# EAGLE design 9DOF-Razor-v14 (EAGLE 5.04)

## Sheet 1 of 2
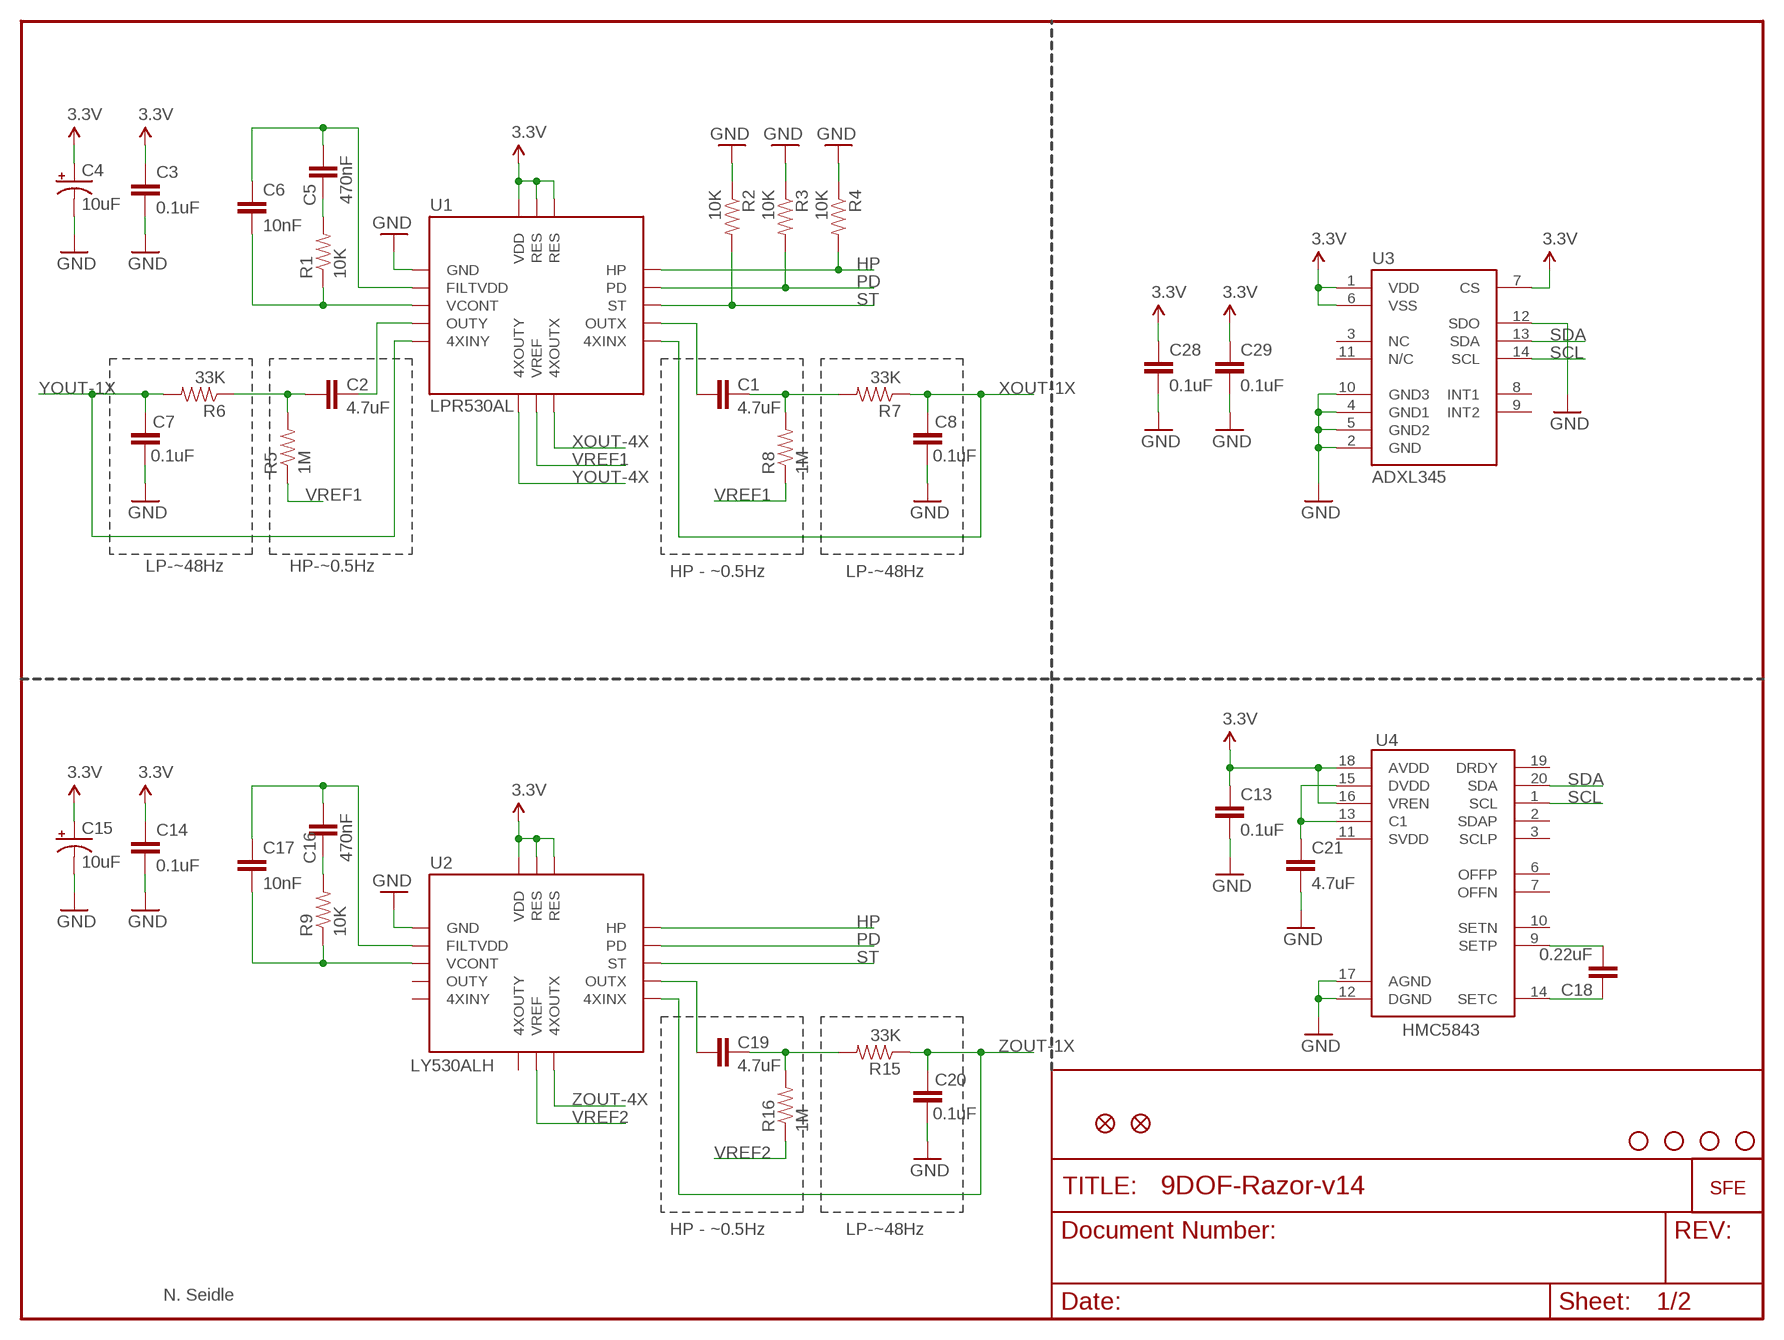
[diagram p0: schematic, sheet 1]

### Parts
C1  4.7uF  CAP0402-CAP  [0402-CAP]
C2  4.7uF  CAP0402-CAP  [0402-CAP]
C3  0.1uF  CAP0402-CAP  [0402-CAP]
C4  10uF  CAP_POL1206  [EIA3216]
C5  470nF  CAP0402-CAP  [0402-CAP]
C6  10nF  CAP0402-CAP  [0402-CAP]
C7  0.1uF  CAP0402-CAP  [0402-CAP]
C8  0.1uF  CAP0402-CAP  [0402-CAP]
C13  0.1uF  CAP0402-CAP  [0402-CAP]
C14  0.1uF  CAP0402-CAP  [0402-CAP]
C15  10uF  CAP_POL1206  [EIA3216]
C16  470nF  CAP0402-CAP  [0402-CAP]
C17  10nF  CAP0402-CAP  [0402-CAP]
C18  0.22uF  CAP0402-CAP  [0402-CAP]
C19  4.7uF  CAP0402-CAP  [0402-CAP]
C20  0.1uF  CAP0402-CAP  [0402-CAP]
C21  4.7uF  CAP0402-CAP  [0402-CAP]
C28  0.1uF  CAP0402-CAP  [0402-CAP]
C29  0.1uF  CAP0402-CAP  [0402-CAP]
JP2  STAND-OFF  [STAND-OFF]
JP3  LOGO-SFENEW  [SFE-NEW-WEBLOGO]
JP4  STAND-OFF  [STAND-OFF]
JP5  STAND-OFF  [STAND-OFF]
JP6  STAND-OFF  [STAND-OFF]
JP8  FIDUCIAL1X2  [FIDUCIAL-1X2]
JP9  FIDUCIAL1X2  [FIDUCIAL-1X2]
R1  10K  RESISTOR0402-RES  [0402-RES]
R2  10K  RESISTOR0402-RES  [0402-RES]
R3  10K  RESISTOR0402-RES  [0402-RES]
R4  10K  RESISTOR0402-RES  [0402-RES]
R5  1M  RESISTOR0402-RES  [0402-RES]
R6  33K  RESISTOR0402-RES  [0402-RES]
R7  33K  RESISTOR0402-RES  [0402-RES]
R8  1M  RESISTOR0402-RES  [0402-RES]
R9  10K  RESISTOR0402-RES  [0402-RES]
R15  33K  RESISTOR0402-RES  [0402-RES]
R16  1M  RESISTOR0402-RES  [0402-RES]
U1  LPR530AL  ST-GYROLGA  [ST-GYRO]
U2  LY530ALH  ST-GYROLGA  [ST-GYRO]
U3  ADXL345  [LGA14]
U4  HMC5843  HMC5843SMD  [LPCC20]

### Nets
3.3V: C3.1 C4.A(+) C13.1 C14.1 C15.A(+) C28.1 C29.1 U1.14(RES) U1.15(RES) U1.16(VDD) U2.14(RES) U2.15(RES) U2.16(VDD) U3.1(VDD) U3.6(VSS) U3.7(CS) U4.16(VREN) U4.18(AVDD) ; also sheet 2
F1: C5.1 C6.1 U1.2(FILTVDD)
F2: C6.2 R1.1 U1.3(VCONT)
F3: C16.1 C17.1 U2.2(FILTVDD)
F4: C17.2 R9.1 U2.3(VCONT)
GND: C3.2 C4.C(-) C7.1 C8.1 C13.2 C14.2 C15.C(-) C20.1 C21.2 C28.2 C29.2 R2.1 R3.1 R4.1 U1.1(GND) U2.1(GND) U3.2(GND) U3.4(GND1) U3.5(GND2) U3.10(GND3) U3.12(SDO) U4.12(DGND) U4.17(AGND) ; also sheet 2
HP: R4.2 U1.13(HP) U2.13(HP) ; also sheet 2
N$1: C2.2 U1.4(OUTY)
N$2: C5.2 R1.2
N$3: C1.1 U1.10(OUTX)
N$4: C2.1 R5.2 R6.1
N$5: C21.1 U4.13(C1) U4.15(DVDD)
N$6: C1.2 R7.2 R8.2
N$7: C18.1 U4.14(SETC)
N$8: C16.2 R9.2
N$9: C19.1 U2.10(OUTX)
N$10: C19.2 R15.2 R16.2
N$11: C18.2 U4.9(SETP)
PD: R3.2 U1.12(PD) U2.12(PD) ; also sheet 2
SCL: U3.14(SCL) U4.1(SCL) ; also sheet 2
SDA: U3.13(SDA) U4.20(SDA) ; also sheet 2
ST: R2.2 U1.11(ST) U2.11(ST) ; also sheet 2
VREF1: R5.1 R8.1 U1.7(VREF) ; also sheet 2
VREF2: R16.1 U2.7(VREF) ; also sheet 2
XOUT-1X: C8.2 R7.1 U1.9(4XINX)
XOUT-4X: U1.8(4XOUTX) ; also sheet 2
YOUT-1X: C7.2 R6.2 U1.5(4XINY)
YOUT-4X: U1.6(4XOUTY) ; also sheet 2
ZOUT-1X: C20.2 R15.1 U2.9(4XINX)
ZOUT-4X: U2.8(4XOUTX) ; also sheet 2
Unconnected: U2.4(OUTY) U2.5(4XINY) U2.6(4XOUTY) U3.3(NC) U3.8(INT1) U3.9(INT2) U3.11(N/C) U4.2(SDAP) U4.3(SCLP) U4.6(OFFP) U4.7(OFFN) U4.10(SETN) U4.11(SVDD) U4.19(DRDY)

### Notes on the sheet
- LP-~48Hz | HP-~0.5Hz
- HP - ~0.5Hz | LP-~48Hz
- HP - ~0.5Hz | LP-~48Hz
- N. Seidle

## Sheet 2 of 2
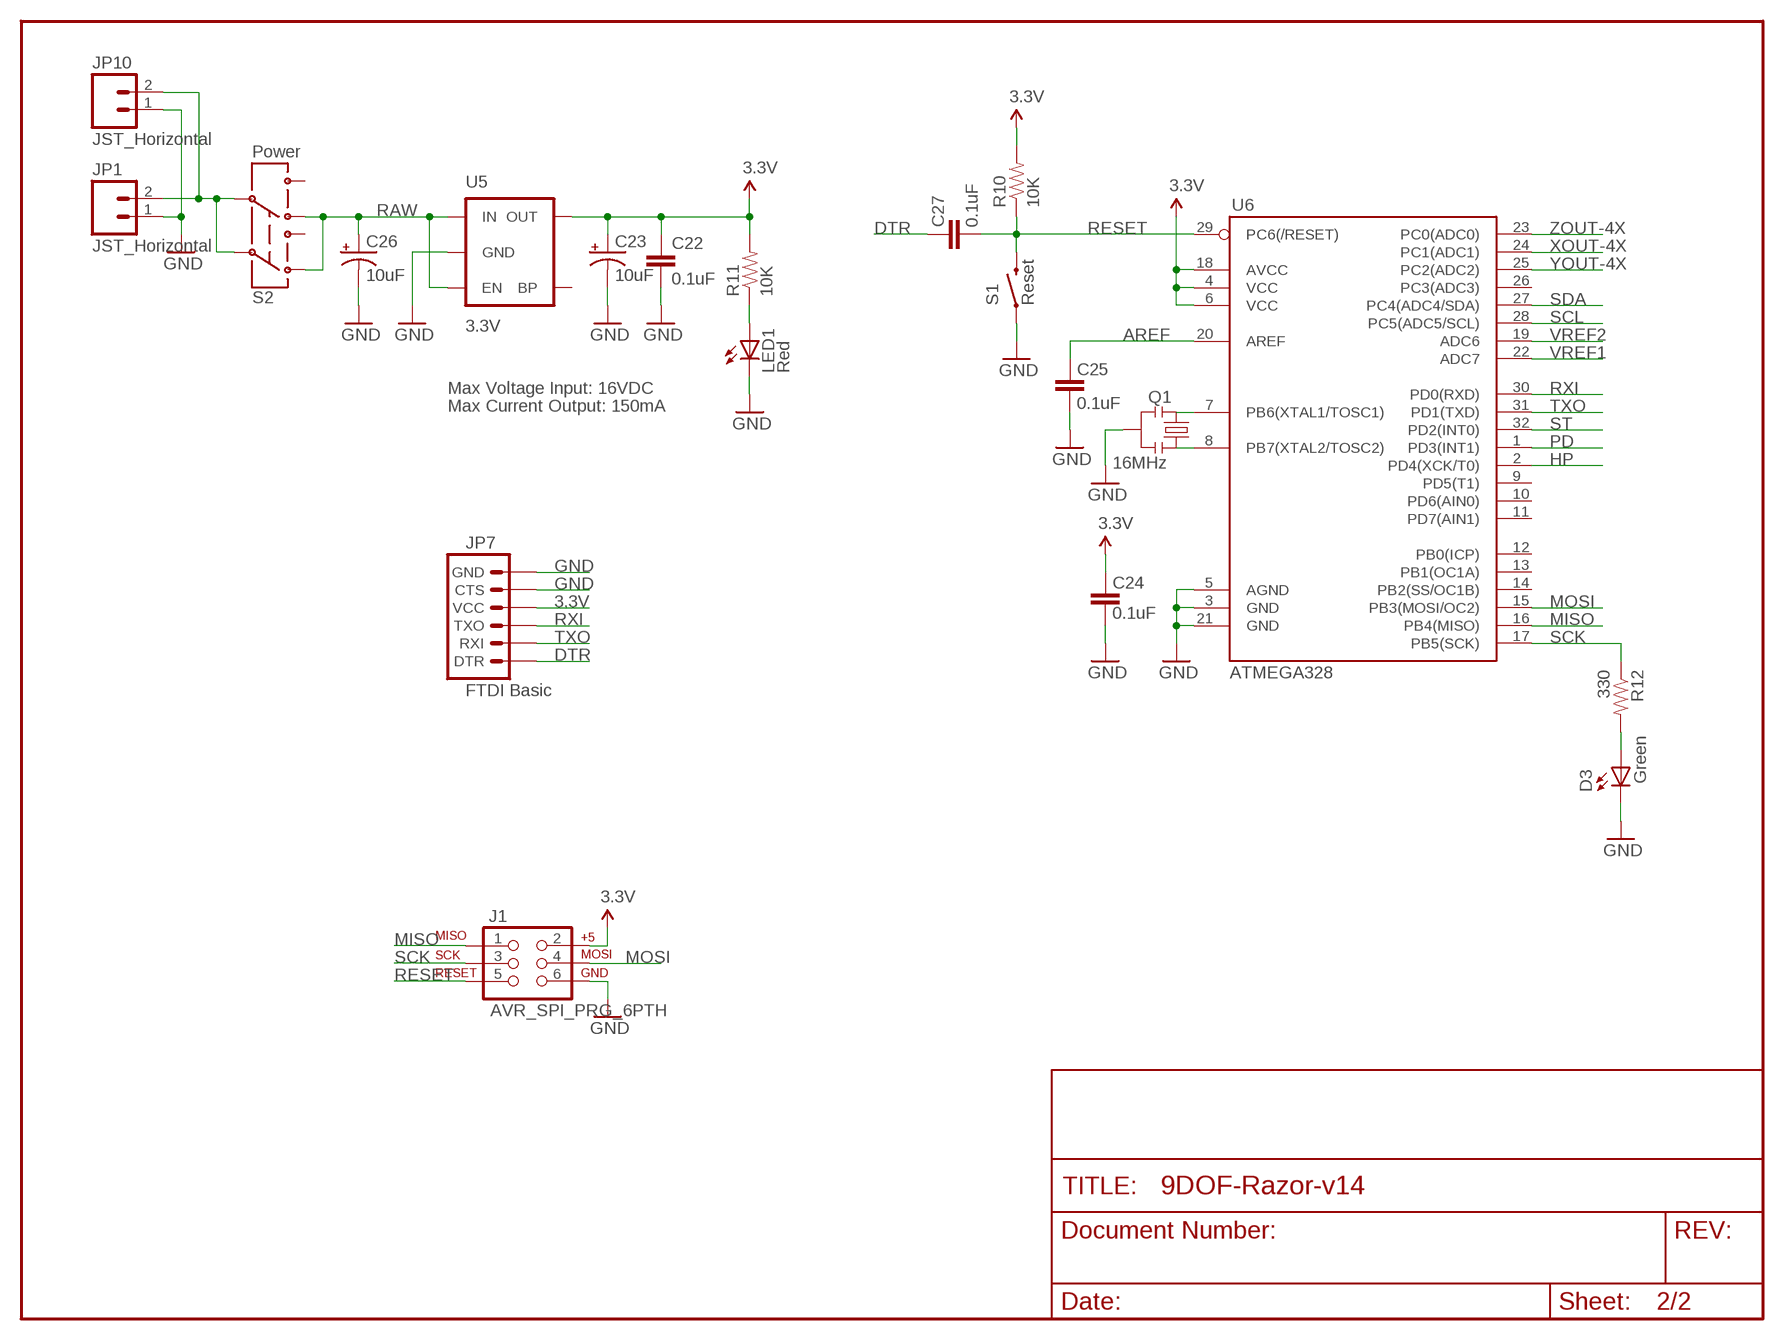
[diagram p1: schematic, sheet 2]

### Parts
C22  0.1uF  CAP0402-CAP  [0402-CAP]
C23  10uF  CAP_POL1206  [EIA3216]
C24  0.1uF  CAP0402-CAP  [0402-CAP]
C25  0.1uF  CAP0402-CAP  [0402-CAP]
C26  10uF  CAP_POL1206  [EIA3216]
C27  0.1uF  CAP0402-CAP  [0402-CAP]
D3  Green  LED0603  [LED-0603]
J1  AVR_SPI_PRG_6PTH  [2X3]
JP1  JST_Horizontal  M02-JST-2MM-SMT  [S2B-PH]
JP7  FTDI Basic  ARDUINO_SERIAL_PROGRAMPTH  [1X06]
JP10  JST_Horizontal  M02PTH  [1X02]
LED1  Red  LED0603  [LED-0603]
Q1  16MHz  RESONATORSMD  [RESONATOR-SMD]
R10  10K  RESISTOR0402-RES  [0402-RES]
R11  10K  RESISTOR0402-RES  [0402-RES]
R12  330  RESISTOR0402-RES  [0402-RES]
S1  Reset  SWITCH-MOMENTARY-2SMD  [TACTILE_SWITCH_SMD]
S2  Power  SWITCH-DPDTSMD  [AYZ0202]
U5  3.3V  V_REG_LDOSMD  [SOT23-5]
U6  ATMEGA328  ATMEGA168  [TQFP32-08]

### Nets
3.3V: C22.1 C23.A(+) C24.2 J1.2 JP7.4(VCC) R10.2 R11.2 U5.5(OUT) U6.4(VCC) U6.6(VCC) U6.18(AVCC) ; also sheet 1
AREF: C25.2 U6.20(AREF)
DTR: C27.2 JP7.1(DTR)
GND: C22.2 C23.C(-) C24.1 C25.1 C26.C(-) D3.C J1.6 JP1.1 JP7.5(CTS) JP7.6(GND) JP10.1 LED1.C Q1.2 S1.1 U5.2(GND) U6.3(GND) U6.5(AGND) U6.21(GND) ; also sheet 1
HP: U6.2(PD4(XCK/T0)) ; also sheet 1
MISO: J1.1 U6.16(PB4(MISO))
MOSI: J1.4 U6.15(PB3(MOSI/OC2))
N$12: D3.A R12.2
N$13: Q1.1 U6.8(PB7(XTAL2/TOSC2))
N$14: Q1.3 U6.7(PB6(XTAL1/TOSC1))
N$15: JP1.2 JP10.2 S2.2 S2.5
N$38: LED1.A R11.1
PD: U6.1(PD3(INT1)) ; also sheet 1
RAW [vcc]: C26.A(+) S2.1 S2.4 U5.1(IN) U5.3(EN)
RESET: C27.1 J1.5 R10.1 S1.3 U6.29(PC6(/RESET))
RXI: JP7.3(TXO) U6.30(PD0(RXD))
SCK: J1.3 R12.1 U6.17(PB5(SCK))
SCL: U6.28(PC5(ADC5/SCL)) ; also sheet 1
SDA: U6.27(PC4(ADC4/SDA)) ; also sheet 1
ST: U6.32(PD2(INT0)) ; also sheet 1
TXO: JP7.2(RXI) U6.31(PD1(TXD))
VREF1: U6.22(ADC7) ; also sheet 1
VREF2: U6.19(ADC6) ; also sheet 1
XOUT-4X: U6.24(PC1(ADC1)) ; also sheet 1
YOUT-4X: U6.25(PC2(ADC2)) ; also sheet 1
ZOUT-4X: U6.23(PC0(ADC0)) ; also sheet 1
Unconnected: S2.3 S2.6 U5.4(BP) U6.9(PD5(T1)) U6.10(PD6(AIN0)) U6.11(PD7(AIN1)) U6.12(PB0(ICP)) U6.13(PB1(OC1A)) U6.14(PB2(SS/OC1B)) U6.26(PC3(ADC3))

### Notes on the sheet
- Max Voltage Input: 16VDC
- Max Current Output: 150mA

## Library data of the parts
C1-C3 C5-C8 C13 C14 C16-C22 C24 C25 C27-C29 = SparkFun:CAP: Capacitor Standard 0603 ceramic capacitor, and 0.1" leaded capacitor.
C4 C15 C23 C26 = SparkFun:CAP_POL: Capacitor Polarized These are standard SMD and PTH capacitors. Normally 10uF, 47uF, and 100uF in electrolytic and tantalum varieties. Always verify the external diameter of the through hole cap, it varies with capacity, voltage, and manufacturer. The EIA devices should be standard.
D3 LED1 = SparkFun:LED: LEDs Standard schematic elements and footprints for 5mm, 3mm, 1206, and 0603 sized LEDs. 5mm - Spark Fun Electronics SKU : COM-00529 (and others)
J1 = SparkFun:AVR_SPI_PRG_6: AVR ISP 6 Pin This is the reduced ISP connector for AVR programming. Common on Arduino. This footprint will take up less PCB space and can be used with a 10-pin to 6-pin adapter such as SKU: BOB-08508
JP1 JP10 = SparkFun:M02: Header 2 Standard 2-pin 0.1" header. Use with straight break away headers (SKU : PRT-00116), right angle break away headers (PRT-00553), swiss pins (PRT-00743), machine pins (PRT-00117), and female headers (PRT-00115). Molex polarized connector foot print use with SKU : PRT-08233 with associated crimp pins and housings.
JP2 JP4-JP6 = SparkFun:STAND-OFF: Stand Off This is the mechanical footprint for a #4 phillips button head screw. Use the keepout ring to avoid running the screw head into surrounding components. SKU : PRT-00447
JP3 = SparkFun:LOGO-SFE: Spark Fun Electronics PCB Logo This is the standard Spark Fun Electronics PCB logo.
JP7 = SparkFun:ARDUINO_SERIAL_PROGRAM
JP8 JP9 = SparkFun:FIDUCIAL: Fiducial Alignment Points Various fiducial points for machine vision alignment.
Q1 = SparkFun:RESONATOR: Resonator Small SMD resonator. This is the itty bitty 10/20MHz resonators with built in caps. CSTCE10M0G55 and CSTCE20M0V53. Footprint has been reviewed closely but hasn't been tested yet.
R1-R12 R15 R16 = SparkFun:RESISTOR: Resistor Basic schematic elements and footprints for 0603, 1206, and PTH 1/10th watt (small) resistors.
S1 = SparkFun:SWITCH-MOMENTARY-2
S2 = SparkFun:SWITCH-DPDT: DPDT Version of the COM-00597, MSS22 is a 125VAC @ 300mA rated switch
U1 U2 = SparkFun:ST-GYRO
U3 = SparkFun:ADXL345
U4 = SparkFun:HMC5843
U5 = SparkFun:V_REG_LDO: Voltage Regulator LDO Standard 150mA LDO voltage regulator in SOT-23 layout. Micrel part MIC5205. BP (by-pass) pin is used to lower output noise with 470pF cap.
U6 = SparkFun:ATMEGA168

## Net classes
1 vcc: width 0.254 mm

## Board
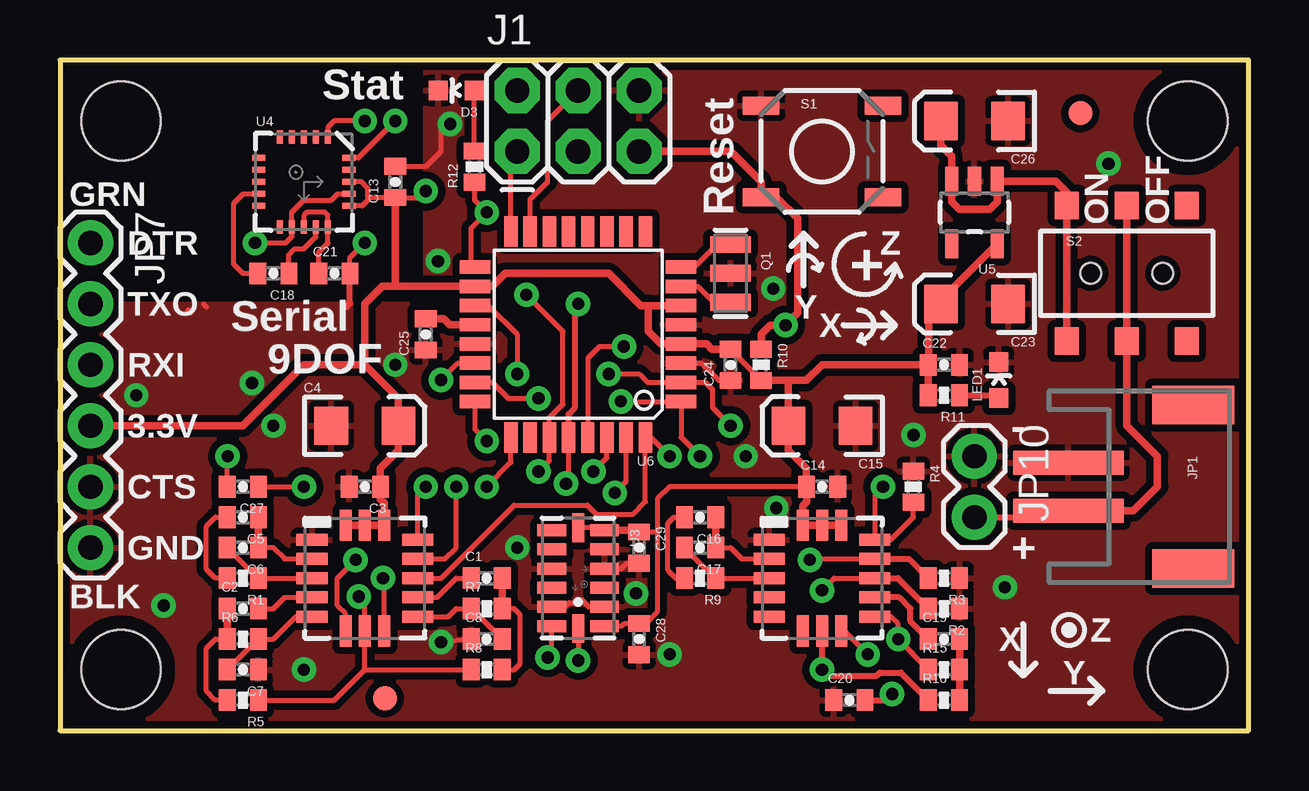
[diagram p2: board, top side]
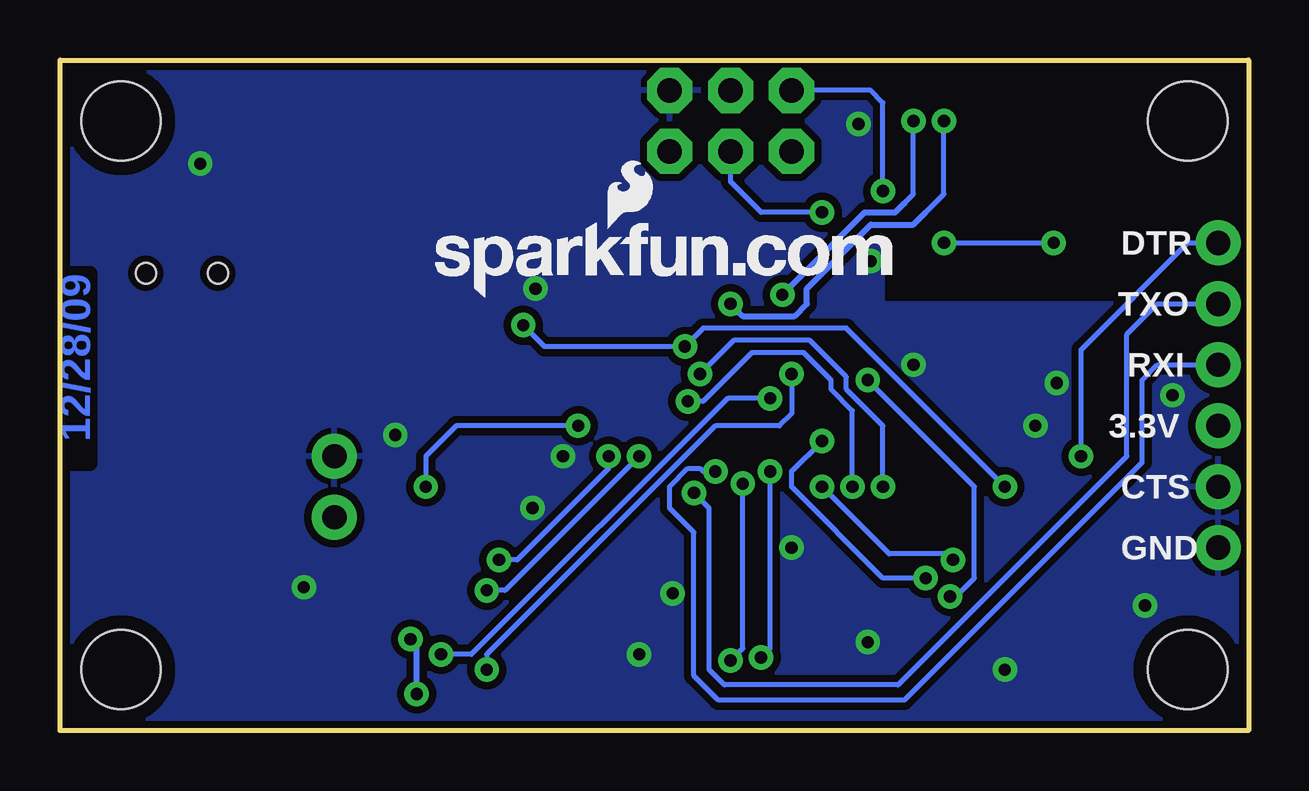
[diagram p3: board, bottom side, seen from below]

Size 49.53 x 27.94 mm. Coordinates in mm from the lower left corner, seen from the top.
Outline: 0,0 49.53,0 49.53,27.94 0,27.94 0,0
Copper layers (1*16): Top 0.035mm / dielectric 1.5mm / Bottom 0.035mm
Design rules "SparkFun": minimum track width 8mil, minimum drill 20mil, track to track 8mil, track to pad 8mil, pad to pad 8mil, via to via 8mil, smd to smd 8mil, copper to edge 9mil, drill to drill 8mil, minimum pad ring 12mil, minimum via ring 10mil, stop-mask expansion 4mil, vias tented up to drill 20mil, thermal gap 10mil

### Footprints (pad centres in the part's own frame; a part is rotated, then mirrored left to right if it is on the bottom)
0402-CAP = smd 0.7 x 0.9: 1 -0.65,0; 2 0.65,0
EIA3216 = smd 1.4 x 1.6: A 1.4,0; C -1.4,0
LED-0603 = smd 0.8 x 0.8: A 0,-0.75; C 0,0.75
2X3 = drill 1.016 pad 1.88 octagon: 1 0,0; 2 0,2.54; 3 2.54,0; 4 2.54,2.54; 5 5.08,0; 6 5.08,2.54
S2B-PH = smd 1 x 4.6: 1 -1,-3.7; 2 1,-3.7 | smd 1.6 x 3.4: NC1 -3.4,1.5; NC2 3.4,1.5
STAND-OFF = hole 3.302: 0,0
1X06 = drill 1.016 pad 1.88 round: 1 0,0; 2 2.54,0; 3 5.08,0; 4 7.62,0; 5 10.16,0; 6 12.7,0
FIDUCIAL-1X2 = smd 1 x 1: 1 0,0
1X02 = drill 1.016 pad 1.88 round: 1 0,0; 2 2.54,0
RESONATOR-SMD = smd 0.7 x 1.7: 1 -1.2,0; 2 0,0; 3 1.2,0
0402-RES = smd 0.7 x 0.9: 1 -0.65,0; 2 0.65,0
TACTILE_SWITCH_SMD = smd 1.524 x 0.762: 1 -2.54,1.905; 2 2.54,1.905; 3 -2.54,-1.905; 4 2.54,-1.905
AYZ0202 = smd 1 x 1.15: 1 -2.5,2.825; 2 0,2.825; 3 2.5,2.825; 4 -2.5,-2.825; 5 0,-2.825; 6 2.5,-2.825 | hole 0.85: 1.5,0; -1.5,0
ST-GYRO@1 = smd 1.3 x 0.5: 1 -2.2,1.6; 2 -2.2,0.8; 3 -2.2,0; 4 -2.2,-0.8; 5 -2.2,-1.6; 9 2.2,-1.6; 10 2.2,-0.8; 11 2.2,0; 12 2.2,0.8; 13 2.2,1.6 | smd 0.5 x 1.3: 6 -0.8,-2.2; 7 0,-2.2; 8 0.8,-2.2; 14 0.8,2.2; 15 0,2.2; 16 -0.8,2.2
LGA14 = smd 0.5 x 1.2: 1 2,1.1; 2 1.2,1.1; 3 0.4,1.1; 4 -0.4,1.1; 5 -1.2,1.1; 6 -2,1.1; 8 -2,-1.1; 9 -1.2,-1.1; 10 -0.4,-1.1; 11 0.4,-1.1; 12 1.2,-1.1; 13 2,-1.1 | smd 1.2 x 0.5: 7 -2.1,0; 14 2.1,0
LPCC20 = smd 0.25 x 0.56: 1 1,1.88; 2 0.5,1.88; 3 0,1.88; 4 -0.5,1.88; 5 -1,1.88; 11 -1,-1.88; 12 -0.5,-1.88; 13 0,-1.88; 14 0.5,-1.88; 15 1,-1.88 | smd 0.56 x 0.25: 6 -1.88,1; 7 -1.88,0.5; 8 -1.88,0; 9 -1.88,-0.5; 10 -1.88,-1; 16 1.88,-1; 17 1.88,-0.5; 18 1.88,0; 19 1.88,0.5; 20 1.88,1
SOT23-5 = smd 0.55 x 1.2: 1 -0.95,-1.3; 2 0,-1.3; 3 0.95,-1.3; 4 0.95,1.3; 5 -0.95,1.3
TQFP32-08 = smd 1.27 x 0.559: 1 -4.293,2.8; 2 -4.293,2; 3 -4.293,1.2; 4 -4.293,0.4; 5 -4.293,-0.4; 6 -4.293,-1.2; 7 -4.293,-2; 8 -4.293,-2.8; 17 4.293,-2.8; 18 4.293,-2; 19 4.293,-1.2; 20 4.293,-0.4; 21 4.293,0.4; 22 4.293,1.2; 23 4.293,2; 24 4.293,2.8 | smd 0.559 x 1.27: 9 -2.8,-4.293; 10 -2,-4.293; 11 -1.2,-4.293; 12 -0.4,-4.293; 13 0.4,-4.293; 14 1.2,-4.293; 15 2,-4.293; 16 2.8,-4.293; 25 2.8,4.293; 26 2,4.293; 27 1.2,4.293; 28 0.4,4.293; 29 -0.4,4.293; 30 -1.2,4.293; 31 -2,4.293; 32 -2.8,4.293

### Placement (x,y rotation side)
C1  17.78,6.35 0 top
C2  7.62,5.08 0 top
C3  12.7,10.16 180 top
C4  12.7,12.7 0 top
C5  7.62,8.89 180 top
C6  7.62,7.62 180 top
C7  7.62,2.54 180 top
C8  17.78,3.81 0 top
C13  13.97,22.86 90 top
C14  31.75,10.16 0 top
C15  31.75,12.7 180 top
C16  26.67,8.89 180 top
C17  26.67,7.62 180 top
C18  8.89,19.05 180 top
C19  36.83,3.81 0 top
C20  32.89,1.27 0 top
C21  11.43,19.05 0 top
C22  36.83,15.24 0 top
C23  38.1,17.78 180 top
C24  27.94,15.24 90 top
C25  15.24,16.51 90 top
C26  38.1,25.4 180 top
C27  7.62,10.16 180 top
C28  24.13,3.81 270 top
C29  24.13,7.62 270 top
D3  16.51,26.67 90 top
J1  19.05,24.13 0 top
JP1  45.72,10.16 270 top
JP2  2.54,25.4 90 top
JP3  33.91,18.03 0 bottom
JP4  2.54,2.54 90 top
JP5  46.99,25.4 90 top
JP6  46.99,2.54 90 top
JP7  1.27,20.32 270 top
JP8  13.54,1.35 0 top
JP9  42.52,25.73 0 top
JP10  38.1,11.43 270 top
LED1  39.12,14.61 0 top
Q1  27.94,19.05 270 top
R1  7.62,6.35 180 top
R2  36.83,5.08 180 top
R3  36.83,6.35 180 top
R4  35.56,10.16 270 top
R5  7.62,1.27 180 top
R6  7.62,3.81 0 top
R7  17.78,5.08 0 top
R8  17.78,2.54 0 top
R9  26.67,6.35 180 top
R10  29.21,15.24 270 top
R11  36.83,13.97 180 top
R12  17.27,23.5 90 top
R15  36.83,2.54 0 top
R16  36.83,1.27 0 top
S1  31.75,24.13 0 top
S2  44.45,19.05 0 top
U1  LPR530AL  [ST-GYRO@1]  12.7,6.35 0 top
U2  LY530ALH  [ST-GYRO@1]  31.75,6.35 0 top
U3  21.59,6.35 270 top
U4  10.16,22.86 0 top
U5  38.1,21.59 180 top
U6  21.59,16.51 180 top

### Tracks (layer width: path | path; a pad name or v marks a point on that pad's centre or on a via)
3.3V  (via drill 0.51)
  Top 0.203: U4.16 12.59,21.86 12.83,22.1 12.83,22.23 | U4.18 12.57,22.86 12.83,22.61 12.83,22.23 | 12.83,22.23 12.84,22.21 C13.1 14.97,22.21 v15.24,22.48 | U3.1 23.4,4.35 23.5,4.45 24.11,4.45 C28.1 24.4,4.46 24.89,4.95 24.89,8.26 | 24.89,8.26 24.89,9.65 25.4,10.16 C14.1 | C29.1 24.88,8.27 24.89,8.26 | C24.2 27.94,15.86 R10.2 | U3.7 22.59,8.45 U3.6
  Top 0.305: U2.14 U2.15 U2.16 30.95,9.36 31.11,9.53 31.11,10.14 C14.1 31.1,10.94 30.35,11.69 C15.A 30.35,14.47 30.23,14.59 | C24.2 27.16,15.89 26.94,16.11 U6.4 25.04,16.11 24.51,16.64 24.51,17.71 | U1.16 U1.15 U1.14 13.5,9.49 13.35,9.64 C3.1 13.35,10.94 14.1,11.69 C4.A | C4.A | 24.51,17.71 24.2,17.71 22.86,19.05 18.54,19.05 18,18.51 U6.18 13.97,18.51 | 24.51,17.71 U6.6 | C22.1 36.2,15.26 36.2,17.27 C23.A 36.7,17.94 U5.5 | C22.1 R11.2 | R10.2 30.23,14.59 | 30.23,14.59 31.1,14.59 31.75,15.24 C22.1 | U3.6 24.05,8.35 C29.1 | JP7.4 7.62,12.7 10.16,15.24 12.7,15.24 | C4.A 14.1,13.84 12.7,15.24 | 13.97,18.51 13.43,18.51 12.7,17.78 12.7,15.24 | 13.97,18.51 C13.1
  Bottom 0.203: J1.2 15.75,26.67 15.24,26.16 v15.24,22.48
AREF
  Top 0.305: U6.20 16.24,16.91 15.99,17.16 C25.2
DTR  (via drill 0.51)
  Top 0.203: C27.2 6.97,11.41 v6.99,11.43
  Bottom 0.203: v6.99,11.43 6.99,15.88 2.54,20.32 JP7.1
F1
  Top 0.203: U1.2 9.36,7.15 8.89,7.62 C6.1
  Top 0.305: C6.1 C5.1
F2
  Top 0.203: C6.2 8.24,6.35 R1.1 U1.3
F3
  Top 0.203: U2.2 28.41,7.15 27.94,7.62 C17.1
  Top 0.305: C16.1 C17.1
F4
  Top 0.203: C17.2 27.29,6.35 R9.1 U2.3
GND  (via drill 0.51)
  Top 0.203: U6.3 26.73,15.31 27.45,14.59 C24.1 | C8.1 v15.88,3.68 | U3.4 23.39,6.75 23.61,6.97 C29.2 | U4.17 11.56,22.36 11.3,22.1 10.16,22.1 9.66,21.6 U4.12 9.66,20.58 9.4,20.32 v8.13,20.32 | U3.2 22.03,5.15 21.72,5.46 21.59,5.33 21.21,5.33 21.02,5.15 U3.12 | C21.2 12.08,19.7 v12.7,20.32 | 5.46,17.4 5.33,17.53 | 6.1,17.65 5.97,17.78 | C13.2 15.26,23.51 15.88,24.13 15.88,25.02 16.26,25.4
  Top 0.254: C21.2 12.08,17.8 11.94,17.65
  Bottom 0.203: v8.13,20.32 v12.7,20.32 13.08,20.32
  other vias: 16.26,25.27 10.16,2.54 8.89,12.7 13.97,15.24 29.72,18.41 28.57,11.43 29.84,9.27 19.05,7.62 24,5.71 25.4,3.17 35.56,12.32 4.32,5.21 43.69,23.62 8,14.48 3.17,13.97 39.37,5.97 15.75,19.56
  pour Bottom (isolate 0.305): 0,17.78 15.24,17.78 15.24,27.94 49.53,27.94 49.53,0 0,0
  pour Top (isolate 0.305): 0,17.78 15.24,17.78 15.24,27.94 49.53,27.94 49.53,0 0,0
HP  (via drill 0.51)
  Top 0.203: v27.94,12.7 27.18,13.46 27.18,14.22 26.89,14.51 U6.2 24.48,14.51 24.13,14.86 v22.86,14.86 | U1.13 14.9,9.82 v15.24,10.16 | R4.2 35.56,8.89 34.62,7.95 U2.13 33.95,9.82 v34.29,10.16
  Bottom 0.203: v34.29,10.16 34.29,11.43 33.02,12.7 v27.94,12.7 | v15.24,10.16 15.24,12.7 16.76,14.22 16.76,14.73 18.29,16.26 21.46,16.26 v22.86,14.86
MISO
  Top 0.203: U6.16 18.79,23.87 J1.1
MOSI
  Top 0.203: U6.15 19.59,22.13 20.32,22.86 20.32,25.4 J1.4
N$1
  Top 0.203: U1.4 9.36,5.55 8.89,5.08 C2.2
N$2
  Top 0.203: R1.2 6.48,6.35 6.1,6.73 6.1,8.51 6.48,8.89 C5.2
N$3
  Top 0.203: U1.10 15.71,5.55 16.51,6.35 C1.1
N$4
  Top 0.203: R5.2 6.48,1.27 6.1,1.65 6.1,3.43 6.48,3.81 R6.1
  Top 0.305: R6.1 C2.1
N$5
  Top 0.203: U4.13 10.16,21.46 10.29,21.59 11.05,21.59 11.16,21.48 U4.15 11.16,20.3 10.78,19.92 C21.1
N$6
  Top 0.203: R8.2 18.92,2.54 19.18,2.79 19.18,4.83 18.92,5.08 R7.2
  Top 0.305: R7.2 C1.2
N$7
  Top 0.203: U4.14 10.66,20.57 10.16,20.07 9.78,20.07 9.53,19.81 9.53,19.07 C18.1
N$8
  Top 0.203: R9.2 25.65,6.35 25.32,6.68 25.32,8.64 25.58,8.89 C16.2
N$9
  Top 0.254: C19.1 35.43,4.56 35.43,5.08 34.96,5.55 U2.10
N$10
  Top 0.305: R16.2 R15.2 C19.2
N$11
  Top 0.203: U4.9 7.63,22.36 7.24,21.97 7.24,19.43 7.62,19.05 C18.2
N$12
  Top 0.203: D3.A 17.26,24.16 R12.2
N$13
  Top 0.203: U6.8 26.42,19.31 27.36,20.25 Q1.1
N$14
  Top 0.203: U6.7 26.57,18.51 27.23,17.85 Q1.3
N$15
  Top 0.254: JP1.2 41.75,8.89 JP10.2
  Top 0.305: JP1.2 44.72,9.16 45.72,10.16 45.72,11.43 44.45,12.7 S2.5 S2.2
N$38
  Top 0.254: R11.1 39,13.97 LED1.A
PD  (via drill 0.51)
  Top 0.203: U2.12 31.28,7.15 v31.24,7.11 | v26.67,11.43 25.88,12.22 U6.1 v23.37,13.71 v23.37,13.72 | U1.12 16.04,7.15 16.51,7.62 v16.51,10.16
  Top 0.254: U2.12 35.38,7.15 R3.2
  Bottom 0.203: v16.51,10.16 16.51,13.34 17.4,14.22 17.4,14.61 18.54,15.75 20.7,15.75 22.73,13.72 v23.37,13.72 | v31.24,7.11 30.48,7.11 26.67,10.92 v26.67,11.43
RAW
  Top 0.305: S2.4 S2.1 41.95,22.44 41.5,22.89 U5.1 39.05,22.03 38.73,21.72 37.47,21.72 37.15,22.03 U5.3 37.15,23.94 36.7,24.39 C26.A
RESET  (via drill 0.51)
  Top 0.203: v23.5,16 22.48,16 21.99,15.51 U6.29 | C27.1 v10.16,10.16
  Top 0.305: R10.1 29.21,16.51 29.59,16.89 v30.23,16.89 30.73,17.4 30.73,21.34 29.84,22.23 S1.3 29.21,22.86 27.94,24.13 J1.5
  Bottom 0.203: 22.99,16.51 v23.5,16 29.34,16 v30.23,16.89 | 22.99,16.51 22.86,16.64 | v10.16,10.16 16.76,16.76 22.73,16.76 22.99,16.51
RXI  (via drill 0.51)
  Top 0.203: U6.30 22.79,11.36 v22.23,10.79
  Bottom 0.203: v22.23,10.79 22.73,10.79 22.86,10.92 23.37,10.92 24.13,10.16 24.13,9.27 23.11,8.26 23.11,2.29 22.1,1.27 14.35,1.27 4.45,11.18 4.45,14.61 3.81,15.24 JP7.3
SCK  (via drill 0.51)
  Top 0.203: U6.17 17.3,19.28 17.13,19.45 17.13,20.94 v17.78,21.59 17.27,22.1 R12.1
  Bottom 0.203: v17.78,21.59 20.32,21.59 21.59,22.86 J1.3
SCL  (via drill 0.51)
  Top 0.203: U3.14 v21.59,2.92 | U6.28 21.19,10.39 v21.08,10.29 | U4.1 11.16,25.13 11.43,25.4 v12.7,25.4
  Top 0.254: U6.28 21.19,13.19 21.46,13.46 21.46,17.65 v21.59,17.78
  Bottom 0.203: v21.08,10.29 21.08,3.43 v21.59,2.92 | v12.7,25.4 12.7,22.35 13.46,21.59
  Bottom 0.254: v21.59,17.78 21.08,17.27 18.92,17.27 18.41,17.78 18.41,18.41 15.75,21.08 13.97,21.08 13.46,21.59
SDA  (via drill 0.51)
  Top 0.203: v19.43,18.16 20.95,16.64 20.95,13.59 20.39,13.02 U6.27 20.39,11.25 v19.94,10.79 | U3.13 20.49,3.22 v20.32,3.05 | U4.20 12.43,23.86 v13.97,25.4
  Bottom 0.203: v19.94,10.79 19.94,3.43 v20.32,3.05 | v13.97,25.4 13.97,22.35 14.35,21.97
  Bottom 0.254: 14.35,21.97 14.73,21.59 16,21.59 v19.43,18.16
ST  (via drill 0.51)
  Top 0.203: U1.11 15.88,6.35 18.92,9.4 21.97,9.4 22.35,9.02 23.88,9.02 24.39,9.53 U6.32 24.61,12.22 v25.4,11.43 | U2.11 32.26,6.35 v31.75,5.84
  Top 0.254: R2.2 34.91,6.35 U2.11
  Bottom 0.203: v31.75,5.84 30.99,5.84 v25.4,11.43
TXO  (via drill 0.51)
  Top 0.203: U6.31 23.59,10.38 v23.11,9.91
  Bottom 0.203: v23.11,9.91 22.48,9.27 22.48,2.54 21.84,1.91 14.61,1.91 5.08,11.43 5.08,16.51 3.81,17.78 JP7.2
VREF1  (via drill 0.51)
  Top 0.203: U6.22 16.58,15.31 v15.88,14.61 | v12.45,5.59 12.7,5.33 U1.7 12.7,2.54 | 12.7,2.54 R8.1 | R5.1 11.43,1.27 12.7,2.54
  Bottom 0.203: v12.45,5.59 12.19,5.59 11.43,6.35 11.43,10.16 v15.88,14.61
VREF2  (via drill 0.51)
  Top 0.203: U6.19 17.85,17.71 19.05,16.51 v19.05,14.86
  Top 0.254: v31.75,2.54 U2.7 | R16.1 35.04,2.41 34.16,2.41 34.04,2.29 32,2.29 v31.75,2.54 | v31.75,2.54 31.88,2.41
  Bottom 0.203: v19.05,14.86 19.05,13.21 19.56,12.7 22.23,12.7 31.75,3.17 v31.75,2.54
XOUT-1X
  Top 0.203: C8.2 17.16,5.08 R7.1 16.51,5.08 16.18,4.75 U1.9
XOUT-4X  (via drill 0.51)
  Top 0.203: U1.8 13.5,6.26 v13.46,6.35 | U6.24 17.3,12.55 v17.78,12.06
  Bottom 0.203: v13.46,6.35 15.24,6.35 19.05,10.16 19.05,10.79 v17.78,12.06
YOUT-1X
  Top 0.203: C7.2 8.24,3.81 R6.2 8.89,3.81 9.83,4.75 U1.5
YOUT-4X  (via drill 0.51)
  Top 0.203: U6.25 18.79,11.17 v17.78,10.16 | U1.6 11.9,4.86 11.56,5.21 11.56,6.35 v12.32,7.11
  Bottom 0.203: v17.78,10.16 14.99,7.37 12.57,7.37 v12.32,7.11
ZOUT-1X  (via drill 0.51)
  Top 0.203: R15.1 v34.92,3.81 34.92,4.45 34.62,4.75 U2.9
  Top 0.254: C20.2 34.42,1.27 v34.67,1.52
  Bottom 0.254: 34.8,3.68 v34.92,3.81 34.67,3.56 v34.67,1.52
ZOUT-4X  (via drill 0.51)
  Top 0.203: U2.8 32.68,4.15 v33.66,3.17 | U6.23 18,14.51 18.67,13.84 v19.94,13.84
  Bottom 0.203: v33.66,3.17 32.38,3.17 21.72,13.84 v19.94,13.84

### Text on the board
Bottom: 12/28/09
tPlace: Stat | GRN | Reset | ON | OFF | DTR | Z | + | TXO | Serial | Y | X | RXI | 9DOF | 3.3V | - | CTS | GND | + | BLK | Z | X | Y
bPlace: DTR | TXO | RXI | 3.3V | CTS | GND